# EAGLE design ws2812-hat (EAGLE 7.2.0)
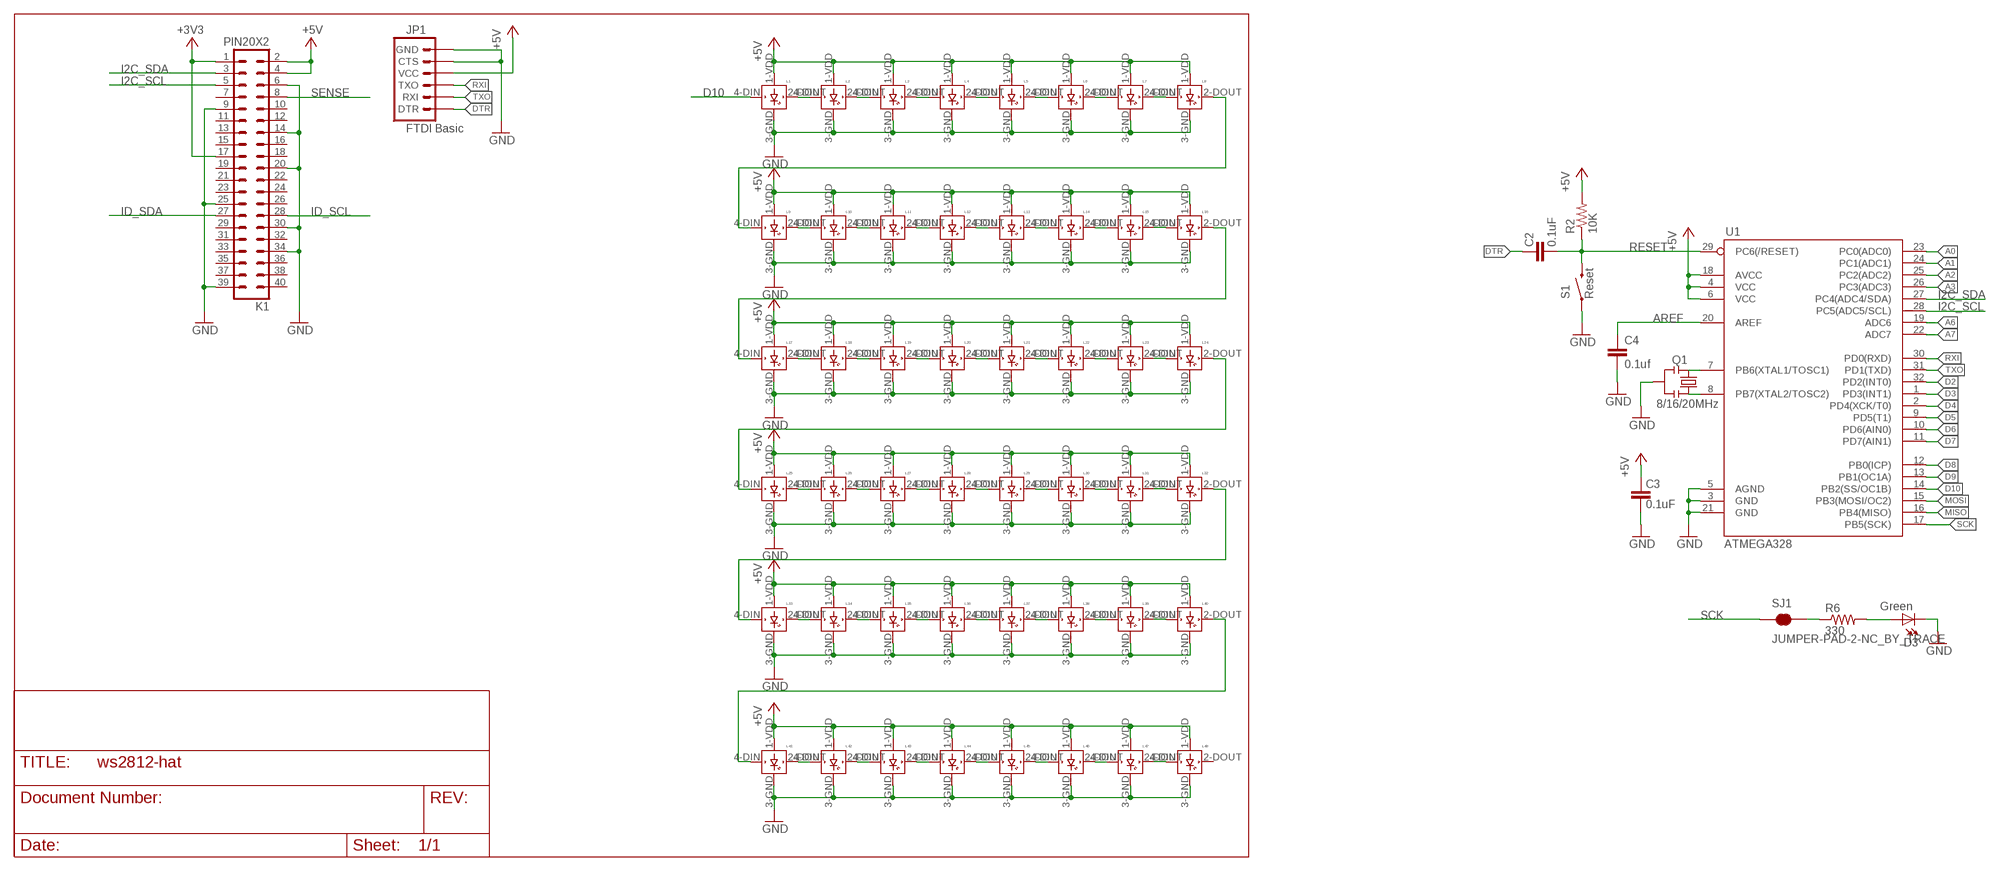
[diagram p0: schematic, sheet 1]

## Parts
C2  0.1uF  CAP0603-CAP  [0603-CAP]
C3  0.1uF  CAP0603-CAP  [0603-CAP]
C4  0.1uf  C-EUC0805K  [C0805K]
D3  Green  LED  [0603-LED-ALT1]
JP1  FTDI Basic  ARDUINO_SERIAL_PROGRAMPTH  [1X06]
K1  PIN20X2  [PIN_20X2]
L1  WS2812B  [WS2812B]
L2  WS2812B  [WS2812B]
L3  WS2812B  [WS2812B]
L4  WS2812B  [WS2812B]
L5  WS2812B  [WS2812B]
L6  WS2812B  [WS2812B]
L7  WS2812B  [WS2812B]
L8  WS2812B  [WS2812B]
L9  WS2812B  [WS2812B]
L10  WS2812B  [WS2812B]
L11  WS2812B  [WS2812B]
L12  WS2812B  [WS2812B]
L13  WS2812B  [WS2812B]
L14  WS2812B  [WS2812B]
L15  WS2812B  [WS2812B]
L16  WS2812B  [WS2812B]
L17  WS2812B  [WS2812B]
L18  WS2812B  [WS2812B]
L19  WS2812B  [WS2812B]
L20  WS2812B  [WS2812B]
L21  WS2812B  [WS2812B]
L22  WS2812B  [WS2812B]
L23  WS2812B  [WS2812B]
L24  WS2812B  [WS2812B]
L25  WS2812B  [WS2812B]
L26  WS2812B  [WS2812B]
L27  WS2812B  [WS2812B]
L28  WS2812B  [WS2812B]
L29  WS2812B  [WS2812B]
L30  WS2812B  [WS2812B]
L31  WS2812B  [WS2812B]
L32  WS2812B  [WS2812B]
L33  WS2812B  [WS2812B]
L34  WS2812B  [WS2812B]
L35  WS2812B  [WS2812B]
L36  WS2812B  [WS2812B]
L37  WS2812B  [WS2812B]
L38  WS2812B  [WS2812B]
L39  WS2812B  [WS2812B]
L40  WS2812B  [WS2812B]
L41  WS2812B  [WS2812B]
L42  WS2812B  [WS2812B]
L43  WS2812B  [WS2812B]
L44  WS2812B  [WS2812B]
L45  WS2812B  [WS2812B]
L46  WS2812B  [WS2812B]
L47  WS2812B  [WS2812B]
L48  WS2812B  [WS2812B]
Q1  8/16/20MHz  RESONATOR1:1  [RESONATOR-SMD-1:1]
R2  10K  RESISTOR0603-RES  [0603-RES]
R6  330  RESISTOR0603-RES  [0603-RES]
S1  Reset  SWITCH-MOMENTARY-2SMD-ALT01  [TACTILE-SWITCH-SMD-ALT01]
SJ1  JUMPER-PAD-2-NC_BY_TRACE  [PAD-JUMPER-2-NC_BY_TRACE_YES_SILK]
U1  ATMEGA328  ATMEGA168  [TQFP32-08]

## Nets
+3V3: K1.1 K1.17
+5V: C3.2 JP1.4(VCC) K1.2 K1.4 L1.1-VDD(VDD) L2.1-VDD(VDD) L3.1-VDD(VDD) L4.1-VDD(VDD) L5.1-VDD(VDD) L6.1-VDD(VDD) L7.1-VDD(VDD) L8.1-VDD(VDD) L9.1-VDD(VDD) L10.1-VDD(VDD) L11.1-VDD(VDD) L12.1-VDD(VDD) L13.1-VDD(VDD) L14.1-VDD(VDD) L15.1-VDD(VDD) L16.1-VDD(VDD) L17.1-VDD(VDD) L18.1-VDD(VDD) L19.1-VDD(VDD) L20.1-VDD(VDD) L21.1-VDD(VDD) L22.1-VDD(VDD) L23.1-VDD(VDD) L24.1-VDD(VDD) L25.1-VDD(VDD) L26.1-VDD(VDD) L27.1-VDD(VDD) L28.1-VDD(VDD) L29.1-VDD(VDD) L30.1-VDD(VDD) L31.1-VDD(VDD) L32.1-VDD(VDD) L33.1-VDD(VDD) L34.1-VDD(VDD) L35.1-VDD(VDD) L36.1-VDD(VDD) L37.1-VDD(VDD) L38.1-VDD(VDD) L39.1-VDD(VDD) L40.1-VDD(VDD) L41.1-VDD(VDD) L42.1-VDD(VDD) L43.1-VDD(VDD) L44.1-VDD(VDD) L45.1-VDD(VDD) L46.1-VDD(VDD) L47.1-VDD(VDD) L48.1-VDD(VDD) R2.2 U1.4(VCC) U1.6(VCC) U1.18(AVCC)
A0: U1.23(PC0(ADC0))
A1: U1.24(PC1(ADC1))
A2: U1.25(PC2(ADC2))
A3: U1.26(PC3(ADC3))
A6: U1.19(ADC6)
A7: U1.22(ADC7)
AREF: C4.1 U1.20(AREF)
D2: U1.32(PD2(INT0))
D3: U1.1(PD3(INT1))
D4: U1.2(PD4(XCK/T0))
D5: U1.9(PD5(T1))
D6: U1.10(PD6(AIN0))
D7: U1.11(PD7(AIN1))
D8: U1.12(PB0(ICP))
D9: U1.13(PB1(OC1A))
D10: L1.4-DIN(DIN) U1.14(PB2(SS/OC1B))
DTR: C2.2 JP1.1(DTR)
GND: C3.1 C4.2 D3.C JP1.5(CTS) JP1.6(GND) K1.6 K1.9 K1.14 K1.20 K1.25 K1.30 K1.34 K1.39 L1.3-GND(GND) L2.3-GND(GND) L3.3-GND(GND) L4.3-GND(GND) L5.3-GND(GND) L6.3-GND(GND) L7.3-GND(GND) L8.3-GND(GND) L9.3-GND(GND) L10.3-GND(GND) L11.3-GND(GND) L12.3-GND(GND) L13.3-GND(GND) L14.3-GND(GND) L15.3-GND(GND) L16.3-GND(GND) L17.3-GND(GND) L18.3-GND(GND) L19.3-GND(GND) L20.3-GND(GND) L21.3-GND(GND) L22.3-GND(GND) L23.3-GND(GND) L24.3-GND(GND) L25.3-GND(GND) L26.3-GND(GND) L27.3-GND(GND) L28.3-GND(GND) L29.3-GND(GND) L30.3-GND(GND) L31.3-GND(GND) L32.3-GND(GND) L33.3-GND(GND) L34.3-GND(GND) L35.3-GND(GND) L36.3-GND(GND) L37.3-GND(GND) L38.3-GND(GND) L39.3-GND(GND) L40.3-GND(GND) L41.3-GND(GND) L42.3-GND(GND) L43.3-GND(GND) L44.3-GND(GND) L45.3-GND(GND) L46.3-GND(GND) L47.3-GND(GND) L48.3-GND(GND) Q1.2 S1.1 S1.2 U1.3(GND) U1.5(AGND) U1.21(GND)
I2C_SCL: K1.5 U1.28(PC5(ADC5/SCL))
I2C_SDA: K1.3 U1.27(PC4(ADC4/SDA))
ID_SCL: K1.28
ID_SDA: K1.27
MISO: U1.16(PB4(MISO))
MOSI: U1.15(PB3(MOSI/OC2))
N$1: L9.2-DOUT(DOUT) L10.4-DIN(DIN)
N$2: L1.2-DOUT(DOUT) L2.4-DIN(DIN)
N$3: L2.2-DOUT(DOUT) L3.4-DIN(DIN)
N$4: L3.2-DOUT(DOUT) L4.4-DIN(DIN)
N$5: L4.2-DOUT(DOUT) L5.4-DIN(DIN)
N$6: L5.2-DOUT(DOUT) L6.4-DIN(DIN)
N$7: L6.2-DOUT(DOUT) L7.4-DIN(DIN)
N$8: L7.2-DOUT(DOUT) L8.4-DIN(DIN)
N$9: L10.2-DOUT(DOUT) L11.4-DIN(DIN)
N$10: L11.2-DOUT(DOUT) L12.4-DIN(DIN)
N$11: L12.2-DOUT(DOUT) L13.4-DIN(DIN)
N$12: L13.2-DOUT(DOUT) L14.4-DIN(DIN)
N$13: L14.2-DOUT(DOUT) L15.4-DIN(DIN)
N$14: L15.2-DOUT(DOUT) L16.4-DIN(DIN)
N$15: L17.2-DOUT(DOUT) L18.4-DIN(DIN)
N$16: L18.2-DOUT(DOUT) L19.4-DIN(DIN)
N$17: L19.2-DOUT(DOUT) L20.4-DIN(DIN)
N$18: L20.2-DOUT(DOUT) L21.4-DIN(DIN)
N$19: L21.2-DOUT(DOUT) L22.4-DIN(DIN)
N$20: L22.2-DOUT(DOUT) L23.4-DIN(DIN)
N$21: L23.2-DOUT(DOUT) L24.4-DIN(DIN)
N$22: L25.2-DOUT(DOUT) L26.4-DIN(DIN)
N$23: L26.2-DOUT(DOUT) L27.4-DIN(DIN)
N$24: L27.2-DOUT(DOUT) L28.4-DIN(DIN)
N$25: L28.2-DOUT(DOUT) L29.4-DIN(DIN)
N$26: L29.2-DOUT(DOUT) L30.4-DIN(DIN)
N$27: L30.2-DOUT(DOUT) L31.4-DIN(DIN)
N$28: L31.2-DOUT(DOUT) L32.4-DIN(DIN)
N$29: D3.A R6.2
N$30: Q1.3 U1.8(PB7(XTAL2/TOSC2))
N$31: Q1.1 U1.7(PB6(XTAL1/TOSC1))
N$32: L33.2-DOUT(DOUT) L34.4-DIN(DIN)
N$33: L34.2-DOUT(DOUT) L35.4-DIN(DIN)
N$34: L35.2-DOUT(DOUT) L36.4-DIN(DIN)
N$35: L36.2-DOUT(DOUT) L37.4-DIN(DIN)
N$36: L37.2-DOUT(DOUT) L38.4-DIN(DIN)
N$37: L38.2-DOUT(DOUT) L39.4-DIN(DIN)
N$38: L39.2-DOUT(DOUT) L40.4-DIN(DIN)
N$39: L41.2-DOUT(DOUT) L42.4-DIN(DIN)
N$40: L42.2-DOUT(DOUT) L43.4-DIN(DIN)
N$41: L43.2-DOUT(DOUT) L44.4-DIN(DIN)
N$42: L44.2-DOUT(DOUT) L45.4-DIN(DIN)
N$43: L45.2-DOUT(DOUT) L46.4-DIN(DIN)
N$44: L46.2-DOUT(DOUT) L47.4-DIN(DIN)
N$45: L47.2-DOUT(DOUT) L48.4-DIN(DIN)
N$46: L8.2-DOUT(DOUT) L9.4-DIN(DIN)
N$47: L16.2-DOUT(DOUT) L17.4-DIN(DIN)
N$48: L24.2-DOUT(DOUT) L25.4-DIN(DIN)
N$49: L40.2-DOUT(DOUT) L41.4-DIN(DIN)
N$50: L32.2-DOUT(DOUT) L33.4-DIN(DIN)
N$51: R6.1 SJ1.2
RESET: C2.1 R2.1 S1.3 S1.4 U1.29(PC6(/RESET))
RXI: JP1.3(TXO) U1.30(PD0(RXD))
SCK: SJ1.1 U1.17(PB5(SCK))
SENSE: K1.8
TXO: JP1.2(RXI) U1.31(PD1(TXD))
Unconnected: K1.7 K1.10 K1.11 K1.12 K1.13 K1.15 K1.16 K1.18 K1.19 K1.21 K1.22 K1.23 K1.24 K1.26 K1.29 K1.31 K1.32 K1.33 K1.35 K1.36 K1.37 K1.38 K1.40 L48.2-DOUT(DOUT)

## Library data of the parts
C2 C3 = SparkFun:CAP: Capacitor Standard 0603 ceramic capacitor, and 0.1" leaded capacitor.
C4 = rcl:C-EU: CAPACITOR, European symbol
D3 = Testing:LED: LEDs Standard schematic elements and footprints for 5mm, 3mm, 1206, and 0603 sized LEDs. 5mm - Spark Fun Electronics SKU : COM-00529 (and others)
JP1 = SparkFun:ARDUINO_SERIAL_PROGRAM
K1 = FLYFISH:PIN20X2
L1-L48 = adafruit:WS2812B
Q1 = Testing:RESONATOR: Resonator Small SMD resonator. This is the itty bitty 10/20MHz resonators with built in caps. CSTCE10M0G55 and CSTCE20M0V53. Footprint for SMD has been used in SFE production for years, and does work okay. 1:1 is an attempt to get larger fillets on the sides so it will be easier to inspect these solders in our AOI machine. The pads have been minimized to match the actual metal under the resonator. To see this relation, it includes an image import of the bottom side of the component. Imported to scale on layer 200.
R2 R6 = SparkFun:RESISTOR: Resistor Basic schematic elements and footprints for 0603, 1206, and PTH resistors.
S1 = Testing:SWITCH-MOMENTARY-2: Various NO switches- pushbuttons, reed, etc
SJ1 = SparkFun-Passives:JUMPER-PAD-2-NC_BY_TRACE
U1 = SparkFun:ATMEGA168

## Net classes
1 vcc: width 0.254 mm

## Board
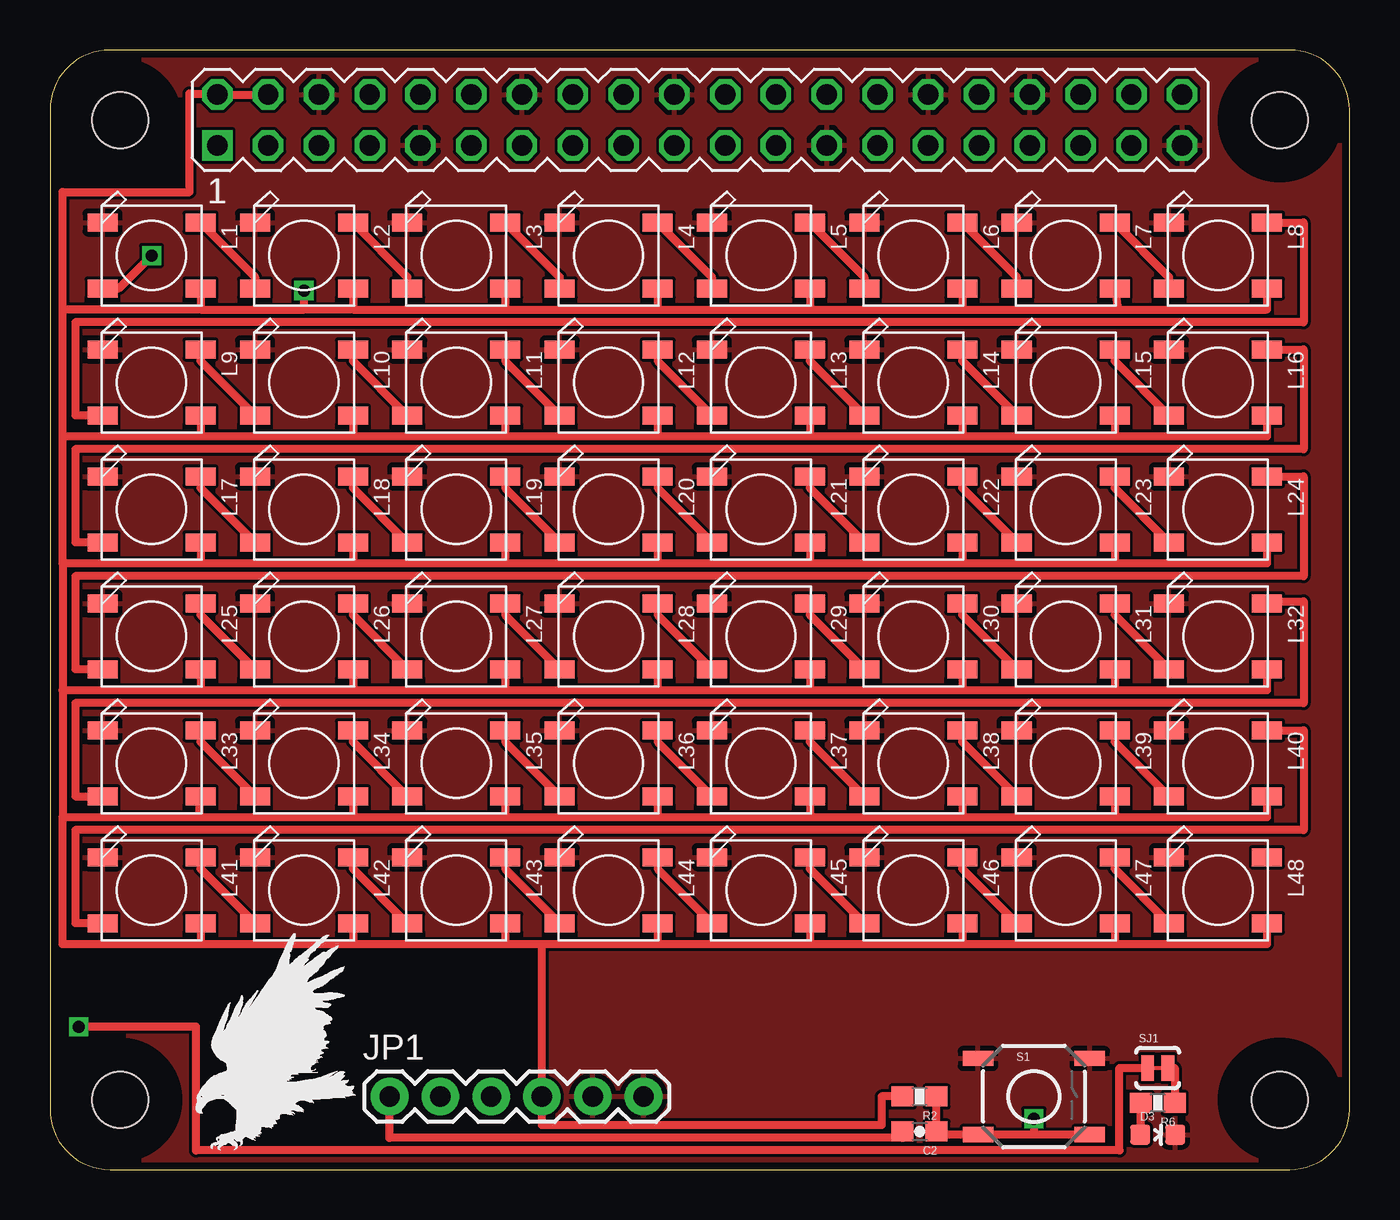
[diagram p1: board, top side]
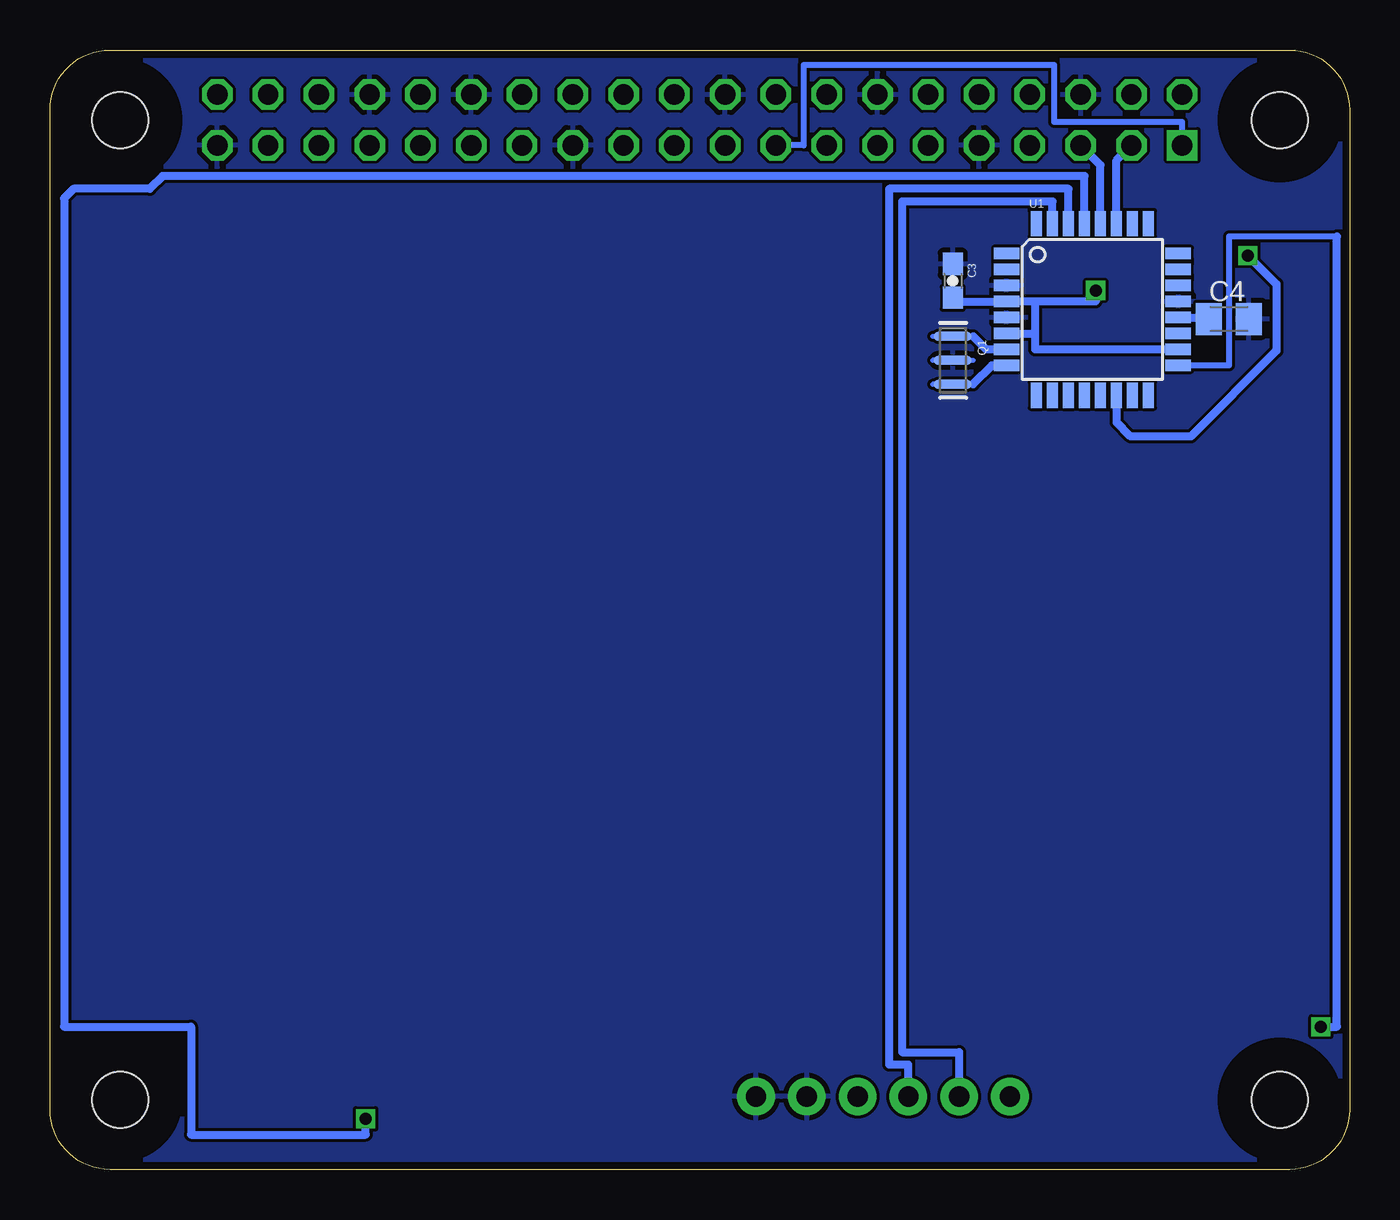
[diagram p2: board, bottom side, seen from below]

Size 65 x 56 mm. Coordinates in mm from the lower left corner, seen from the top.
Outline: 0,3 arc90 3,0 62,0 arc90 65,3 65,53 arc90 62,56 3,56 arc90 0,53 0,3
Copper layers (1*16): Top 0.0356mm / dielectric 1.5011mm / Bottom 0.0356mm
Design rules "LaenPCBOrder": minimum track width 6mil, minimum drill 13mil, track to track 6mil, track to pad 6mil, pad to pad 6mil, via to via 6mil, smd to smd 6mil, copper to edge 15mil, drill to drill 6mil, minimum pad ring 7mil, minimum via ring 7mil, stop-mask expansion 3mil, vias tented up to drill 0mil, thermal gap 10mil
Holes 2.8 mm at 3.5,3.5 3.5,52.5 61.5,52.5 61.5,3.5
tRestrict: area 1.9,51 to 5,54; area 60,51 to 63,54; area 60,1.9 to 63,5; area 1.9,1.9 to 5,5
bRestrict: area 1.9,1.9 to 5,5; area 1.9,51 to 5,54; area 60,1.9 to 63,5; area 60,51 to 63,54

### Footprints (pad centres in the part's own frame; a part is rotated, then mirrored left to right if it is on the bottom)
0603-CAP = smd 1.1 x 1: 1 -0.85,0; 2 0.85,0
C0805K = smd 1.3 x 1.6: 1 -1,0; 2 1,0
0603-LED-ALT1 = smd 1 x 1: A 0,-0.877; C 0,0.877
1X06 = drill 1.016 pad 1.88: 1 0,0; 2 2.54,0; 3 5.08,0; 4 7.62,0; 5 10.16,0; 6 12.7,0
PIN_20X2 = drill 1.016 square: 1 -24.13,-1.27 | drill 1.016 octagon: 2 -24.13,1.27; 3 -21.59,-1.27; 4 -21.59,1.27; 5 -19.05,-1.27; 6 -19.05,1.27; 7 -16.51,-1.27; 8 -16.51,1.27; 9 -13.97,-1.27; 10 -13.97,1.27; 11 -11.43,-1.27; 12 -11.43,1.27; 13 -8.89,-1.27; 14 -8.89,1.27; 15 -6.35,-1.27; 16 -6.35,1.27; 17 -3.81,-1.27; 18 -3.81,1.27; 19 -1.27,-1.27; 20 -1.27,1.27; 21 1.27,-1.27; 22 1.27,1.27; 23 3.81,-1.27; 24 3.81,1.27; 25 6.35,-1.27; 26 6.35,1.27; 27 8.89,-1.27; 28 8.89,1.27; 29 11.43,-1.27; 30 11.43,1.27; 31 13.97,-1.27; 32 13.97,1.27; 33 16.51,-1.27; 34 16.51,1.27; 35 19.05,-1.27; 36 19.05,1.27; 37 21.59,-1.27; 38 21.59,1.27; 39 24.13,-1.27; 40 24.13,1.27
WS2812B = smd 1.5 x 0.9: 1-VDD 2.45,-1.65; 2-DOUT 2.45,1.65; 3-GND -2.45,1.65; 4-DIN -2.45,-1.65
RESONATOR-SMD-1:1 = smd 0.45 x 1.905: 1 -1.2,0; 2 0,0; 3 1.2,0
0603-RES = smd 1.1 x 1: 1 -0.85,0; 2 0.85,0
TACTILE-SWITCH-SMD-ALT01 = smd 1.524 x 0.762: 1 -2.794,1.905; 2 2.794,1.905; 3 -2.794,-1.905; 4 2.794,-1.905
PAD-JUMPER-2-NC_BY_TRACE_YES_SILK = smd 0.635 x 1.27: 1 -0.508,0; 2 0.508,0
TQFP32-08 = smd 1.27 x 0.559: 1 -4.293,2.8; 2 -4.293,2; 3 -4.293,1.2; 4 -4.293,0.4; 5 -4.293,-0.4; 6 -4.293,-1.2; 7 -4.293,-2; 8 -4.293,-2.8; 17 4.293,-2.8; 18 4.293,-2; 19 4.293,-1.2; 20 4.293,-0.4; 21 4.293,0.4; 22 4.293,1.2; 23 4.293,2; 24 4.293,2.8 | smd 0.559 x 1.27: 9 -2.8,-4.293; 10 -2,-4.293; 11 -1.2,-4.293; 12 -0.4,-4.293; 13 0.4,-4.293; 14 1.2,-4.293; 15 2,-4.293; 16 2.8,-4.293; 25 2.8,4.293; 26 2,4.293; 27 1.2,4.293; 28 0.4,4.293; 29 -0.4,4.293; 30 -1.2,4.293; 31 -2,4.293; 32 -2.8,4.293

### Placement (x,y rotation side)
C2  43.5,1.91 180 top
C3  19.84,44.45 270 bottom
C4  6.03,42.55 0 bottom
D3  55.4,1.75 270 top
JP1  16.99,3.65 0 top
K1  32.5,52.5 0 top
L1  5.08,45.72 0 top
L2  12.7,45.72 0 top
L3  20.32,45.72 0 top
L4  27.94,45.72 0 top
L5  35.56,45.72 0 top
L6  43.18,45.72 0 top
L7  50.8,45.72 0 top
L8  58.42,45.72 0 top
L9  5.08,39.37 0 top
L10  12.7,39.37 0 top
L11  20.32,39.37 0 top
L12  27.94,39.37 0 top
L13  35.56,39.37 0 top
L14  43.18,39.37 0 top
L15  50.8,39.37 0 top
L16  58.42,39.37 0 top
L17  5.08,33.02 0 top
L18  12.7,33.02 0 top
L19  20.32,33.02 0 top
L20  27.94,33.02 0 top
L21  35.56,33.02 0 top
L22  43.18,33.02 0 top
L23  50.8,33.02 0 top
L24  58.42,33.02 0 top
L25  5.08,26.67 0 top
L26  12.7,26.67 0 top
L27  20.32,26.67 0 top
L28  27.94,26.67 0 top
L29  35.56,26.67 0 top
L30  43.18,26.67 0 top
L31  50.8,26.67 0 top
L32  58.42,26.67 0 top
L33  5.08,20.32 0 top
L34  12.7,20.32 0 top
L35  20.32,20.32 0 top
L36  27.94,20.32 0 top
L37  35.56,20.32 0 top
L38  43.18,20.32 0 top
L39  50.8,20.32 0 top
L40  58.42,20.32 0 top
L41  5.08,13.97 0 top
L42  12.7,13.97 0 top
L43  20.32,13.97 0 top
L44  27.94,13.97 0 top
L45  35.56,13.97 0 top
L46  43.18,13.97 0 top
L47  50.8,13.97 0 top
L48  58.42,13.97 0 top
Q1  19.84,40.48 270 bottom
R2  43.5,3.65 180 top
R6  55.4,3.33 180 top
S1  49.21,3.65 0 top
SJ1  55.4,5.08 0 top
U1  12.86,43.02 0 bottom
U$1  [EAGLE-PLC-8MM]  7.3,0.95 0 top

### Tracks (layer width: path | path; a pad name or v marks a point on that pad's centre or on a via)
+3V3
  Bottom 0.305: K1.1 8.37,52.39 14.76,52.39 14.76,55.24 27.3,55.24 27.3,51.23 K1.17
+5V  (via drill 0.6)
  Top 0.406: L1.1-VDD 7.53,43.02 | 7.53,43.02 12.7,43.02 | 15.15,43.02 22.77,43.02 | 22.77,43.02 30.39,43.02 | 30.39,43.02 38.01,43.02 | 38.01,43.02 45.63,43.02 | 45.63,43.02 53.41,43.02 | 53.41,43.02 60.87,43.02 L8.1-VDD | L7.1-VDD 53.41,43.02 | L6.1-VDD 45.63,43.02 | L5.1-VDD 38.01,43.02 | L4.1-VDD 30.39,43.02 | L3.1-VDD 22.77,43.02 | 7.53,43.02 0.64,43.02 | 0.64,43.02 0.64,48.9 6.99,48.9 6.99,53.82 8.37,53.82 K1.2 K1.4 | L16.1-VDD 60.87,36.67 53.25,36.67 | 53.25,36.67 45.63,36.67 | 45.63,36.67 38.01,36.67 | 38.01,36.67 30.39,36.67 | 30.39,36.67 22.77,36.67 | 22.77,36.67 15.15,36.67 | 15.15,36.67 7.53,36.67 | 7.53,36.67 0.64,36.67 | L24.1-VDD 60.87,30.32 53.25,30.32 | 53.25,30.32 45.63,30.32 | 45.63,30.32 38.01,30.32 | 38.01,30.32 30.39,30.32 | 30.39,30.32 22.77,30.32 | 22.77,30.32 15.15,30.32 | 15.15,30.32 7.53,30.32 | 7.53,30.32 0.64,30.32 | 0.64,36.67 0.64,43.02 | 0.64,30.32 0.64,36.67 | L32.1-VDD 60.87,23.97 53.25,23.97 | 53.25,23.97 45.63,23.97 | 45.63,23.97 38.01,23.97 | 38.01,23.97 30.39,23.97 | 30.39,23.97 22.77,23.97 | 22.77,23.97 15.15,23.97 | 15.15,23.97 7.53,23.97 | 0.64,30.32 0.64,23.97 | L20.1-VDD 30.39,30.32 | L19.1-VDD 22.77,30.32 | L11.1-VDD 22.77,36.67 | L12.1-VDD 30.39,36.67 | L10.1-VDD 15.15,36.67 | L9.1-VDD 7.53,36.67 | L17.1-VDD 7.53,30.32 | L18.1-VDD 15.15,30.32 | L26.1-VDD 15.15,23.97 | L25.1-VDD 7.53,23.97 | L27.1-VDD 22.77,23.97 | L28.1-VDD 30.39,23.97 | L21.1-VDD 38.01,30.32 | L29.1-VDD 38.01,23.97 | L30.1-VDD 45.63,23.97 | L22.1-VDD 45.63,30.32 | L14.1-VDD 45.63,36.67 | L13.1-VDD 38.01,36.67 | L15.1-VDD 53.25,36.67 | L23.1-VDD 53.25,30.32 | L31.1-VDD 53.25,23.97 | L40.1-VDD 60.87,17.62 53.25,17.62 | 53.25,17.62 45.63,17.62 | 45.63,17.62 38.01,17.62
  Top 0.406: 38.01,17.62 30.39,17.62 | 30.39,17.62 22.77,17.62 | 22.77,17.62 15.15,17.62 | 15.15,17.62 7.46,17.62 | 7.46,17.62 0.64,17.62 | L48.1-VDD 60.87,11.27 53.25,11.27 | 53.25,11.27 45.63,11.27 | 45.63,11.27 38.01,11.27 | 38.01,11.27 30.39,11.27 | 30.39,11.27 24.61,11.27 | 24.61,11.27 22.77,11.27 | 22.77,11.27 15.15,11.27 | 15.15,11.27 7.53,11.27 | 7.53,11.27 0.64,11.27 0.64,17.62 | 7.53,23.97 0.64,23.97 | 0.64,23.97 0.64,17.62 | L33.1-VDD 7.46,18.67 7.46,17.62 | L34.1-VDD 15.15,17.62 | L35.1-VDD 22.77,17.62 | L36.1-VDD 30.39,17.62 | L37.1-VDD 38.01,17.62 | L39.1-VDD 53.25,17.62 | L38.1-VDD 45.63,17.62 | L45.1-VDD 38.01,11.27 | L46.1-VDD 45.63,11.27 | L47.1-VDD 53.25,11.27 | L44.1-VDD 30.39,11.27 | L43.1-VDD 22.77,11.27 | L42.1-VDD 15.15,11.27 | L41.1-VDD 7.53,11.27 | L2.1-VDD 15.15,43.02 | 15.15,43.02 12.7,43.02 | 12.7,43.02 v12.7,43.97 | 24.61,11.27 JP1.4 24.61,2.22 41.59,2.22 41.59,3.65 R2.2
  Bottom 0.406: v12.7,43.97 12.7,43.42 15.72,43.42 | 15.72,43.42 U1.4 19.84,43.42 C3.2 | U1.6 15.72,41.82 | 15.72,41.82 15.72,43.42 | U1.18 15.72,41.02 15.72,41.82
AREF
  Bottom 0.406: U1.20 7.14,42.62 | 7.14,42.62 7.04,42.62 | C4.1 7.07,42.55 7.14,42.62
D10  (via drill 0.6)
  Top 0.406: L1.4-DIN 3.43,44.07 v5.08,45.72
  Bottom 0.406: v5.08,45.72 3.65,44.29 3.65,40.96 7.94,36.67 10.95,36.67 11.66,37.38 U1.14
DTR
  Top 0.406: JP1.1 16.99,2.06 16.99,1.91 16.99,1.59 42.65,1.59 C2.2
GND
  pour Bottom: 0,3 arc90 3,0 62,0 arc90 65,3 65,53 arc90 62,56 3,56 arc90 0,53
  pour Top: 0,3 arc90 3,0 62,0 arc90 65,3 65,53 arc90 62,56 3,56 arc90 0,53 0.05,36.82
I2C_SCL
  Bottom 0.406: U1.28 12.46,50.24 K1.5
I2C_SDA
  Bottom 0.406: U1.27 11.66,50.48 K1.3
N$1
  Top 0.406: L9.2-DOUT 7.53,40.44 L10.4-DIN
N$2
  Top 0.406: L1.2-DOUT 10.25,44.65 L2.4-DIN
N$3
  Top 0.406: L2.2-DOUT 17.87,44.65 L3.4-DIN
N$4
  Top 0.406: L3.2-DOUT 25.49,44.65 L4.4-DIN
N$5
  Top 0.406: L4.2-DOUT 33.11,44.65 L5.4-DIN
N$6
  Top 0.406: L5.2-DOUT 40.73,44.65 L6.4-DIN
N$7
  Top 0.406: L6.2-DOUT 48.35,44.65 L7.4-DIN
N$8
  Top 0.406: L7.2-DOUT 55.97,44.65 L8.4-DIN
N$9
  Top 0.406: L10.2-DOUT 15.15,40.44 L11.4-DIN
N$10
  Top 0.406: L11.2-DOUT 22.77,40.44 L12.4-DIN
N$11
  Top 0.406: L12.2-DOUT 30.39,40.44 L13.4-DIN
N$12
  Top 0.406: L13.2-DOUT 38.01,40.44 L14.4-DIN
N$13
  Top 0.406: L14.2-DOUT 45.63,40.44 L15.4-DIN
N$14
  Top 0.406: L15.2-DOUT 53.25,40.44 L16.4-DIN
N$15
  Top 0.406: L17.2-DOUT 7.53,34.09 L18.4-DIN
N$16
  Top 0.406: L18.2-DOUT 15.15,34.09 L19.4-DIN
N$17
  Top 0.406: L19.2-DOUT 22.77,34.09 L20.4-DIN
N$18
  Top 0.406: L20.2-DOUT 30.39,34.09 L21.4-DIN
N$19
  Top 0.406: L21.2-DOUT 38.01,34.09 L22.4-DIN
N$20
  Top 0.406: L22.2-DOUT 45.63,34.09 L23.4-DIN
N$21
  Top 0.406: L23.2-DOUT 53.25,34.09 L24.4-DIN
N$22
  Top 0.406: L25.2-DOUT 7.53,27.74 L26.4-DIN
N$23
  Top 0.406: L26.2-DOUT 15.15,27.74 L27.4-DIN
N$24
  Top 0.406: L27.2-DOUT 22.77,27.74 L28.4-DIN
N$25
  Top 0.406: L28.2-DOUT 30.39,27.74 L29.4-DIN
N$26
  Top 0.406: L29.2-DOUT 38.01,27.74 L30.4-DIN
N$27
  Top 0.406: L30.2-DOUT 45.63,27.74 L31.4-DIN
N$28
  Top 0.406: L31.2-DOUT 53.25,27.74 L32.4-DIN
N$29
  Top 0.406: D3.A 54.55,1.75 R6.2
N$30
  Bottom 0.406: U1.8 17.89,40.22 18.83,39.28
N$31
  Bottom 0.406: U1.7 18.17,41.02 18.83,41.68
N$32
  Top 0.406: L33.2-DOUT 7.53,21.39 L34.4-DIN
N$33
  Top 0.406: L34.2-DOUT 15.15,21.39 L35.4-DIN
N$34
  Top 0.406: L35.2-DOUT 22.77,21.39 L36.4-DIN
N$35
  Top 0.406: L36.2-DOUT 30.39,21.39 L37.4-DIN
N$36
  Top 0.406: L37.2-DOUT 38.01,21.39 L38.4-DIN
N$37
  Top 0.406: L38.2-DOUT 45.63,21.39 L39.4-DIN
N$38
  Top 0.406: L39.2-DOUT 53.25,21.39 L40.4-DIN
N$39
  Top 0.406: L41.2-DOUT 7.53,15.04 L42.4-DIN
N$40
  Top 0.406: L42.2-DOUT 15.15,15.04 L43.4-DIN
N$41
  Top 0.406: L43.2-DOUT 22.77,15.04 L44.4-DIN
N$42
  Top 0.406: L44.2-DOUT 30.39,15.04 L45.4-DIN
N$43
  Top 0.406: L45.2-DOUT 38.01,15.04 L46.4-DIN
N$44
  Top 0.406: L46.2-DOUT 45.63,15.04 L47.4-DIN
N$45
  Top 0.406: L47.2-DOUT 53.25,15.04 L48.4-DIN
N$46
  Top 0.406: L8.2-DOUT 62.71,47.37 62.71,42.39 1.27,42.39 1.27,37.72 L9.4-DIN
N$47
  Top 0.406: L16.2-DOUT 62.71,41.02 62.71,36.04 1.27,36.04 1.27,31.37 L17.4-DIN
N$48
  Top 0.406: L24.2-DOUT 62.71,34.67 62.71,29.69 1.27,29.69 1.27,25.02 L25.4-DIN
N$49
  Top 0.406: L40.2-DOUT 62.71,21.97 62.71,16.99 1.27,16.99 1.27,12.32 L41.4-DIN
N$50
  Top 0.406: L32.2-DOUT 60.87,28.42 62.71,28.42 62.71,23.34 1.27,23.34 1.27,18.67 L33.4-DIN
N$51
  Top 0.406: SJ1.2 56.25,5.08 R6.1
RESET  (via drill 0.6)
  Top 0.406: S1.4 49.21,1.75 | v49.21,2.54 49.21,1.75 | 49.21,1.75 S1.3 44.35,1.75 C2.1 R2.1
  Bottom 0.406: U1.29 13.26,49.69 59.37,49.69 60.01,49.05 63.82,49.05 64.29,48.58 64.29,7.14 57.94,7.14 57.94,1.75 49.21,1.75 v49.21,2.54
RXI
  Bottom 0.406: U1.30 14.06,49.05 23.02,49.05 23.02,5.24 22.07,5.24 JP1.3
SCK  (via drill 0.6)
  Top 0.406: v1.43,7.14 7.3,7.14 7.3,0.95 53.5,0.95 53.5,5.08 SJ1.1
  Bottom 0.305: 0.64,46.67 6.03,46.67 6.03,40.22 U1.17
  Bottom 0.406: v1.43,7.14 0.64,7.14 0.64,46.67
TXO
  Bottom 0.406: U1.31 14.86,48.42 22.38,48.42 22.38,5.87 19.53,5.87 JP1.2